# Altium project DecadeBox.PrjPcb
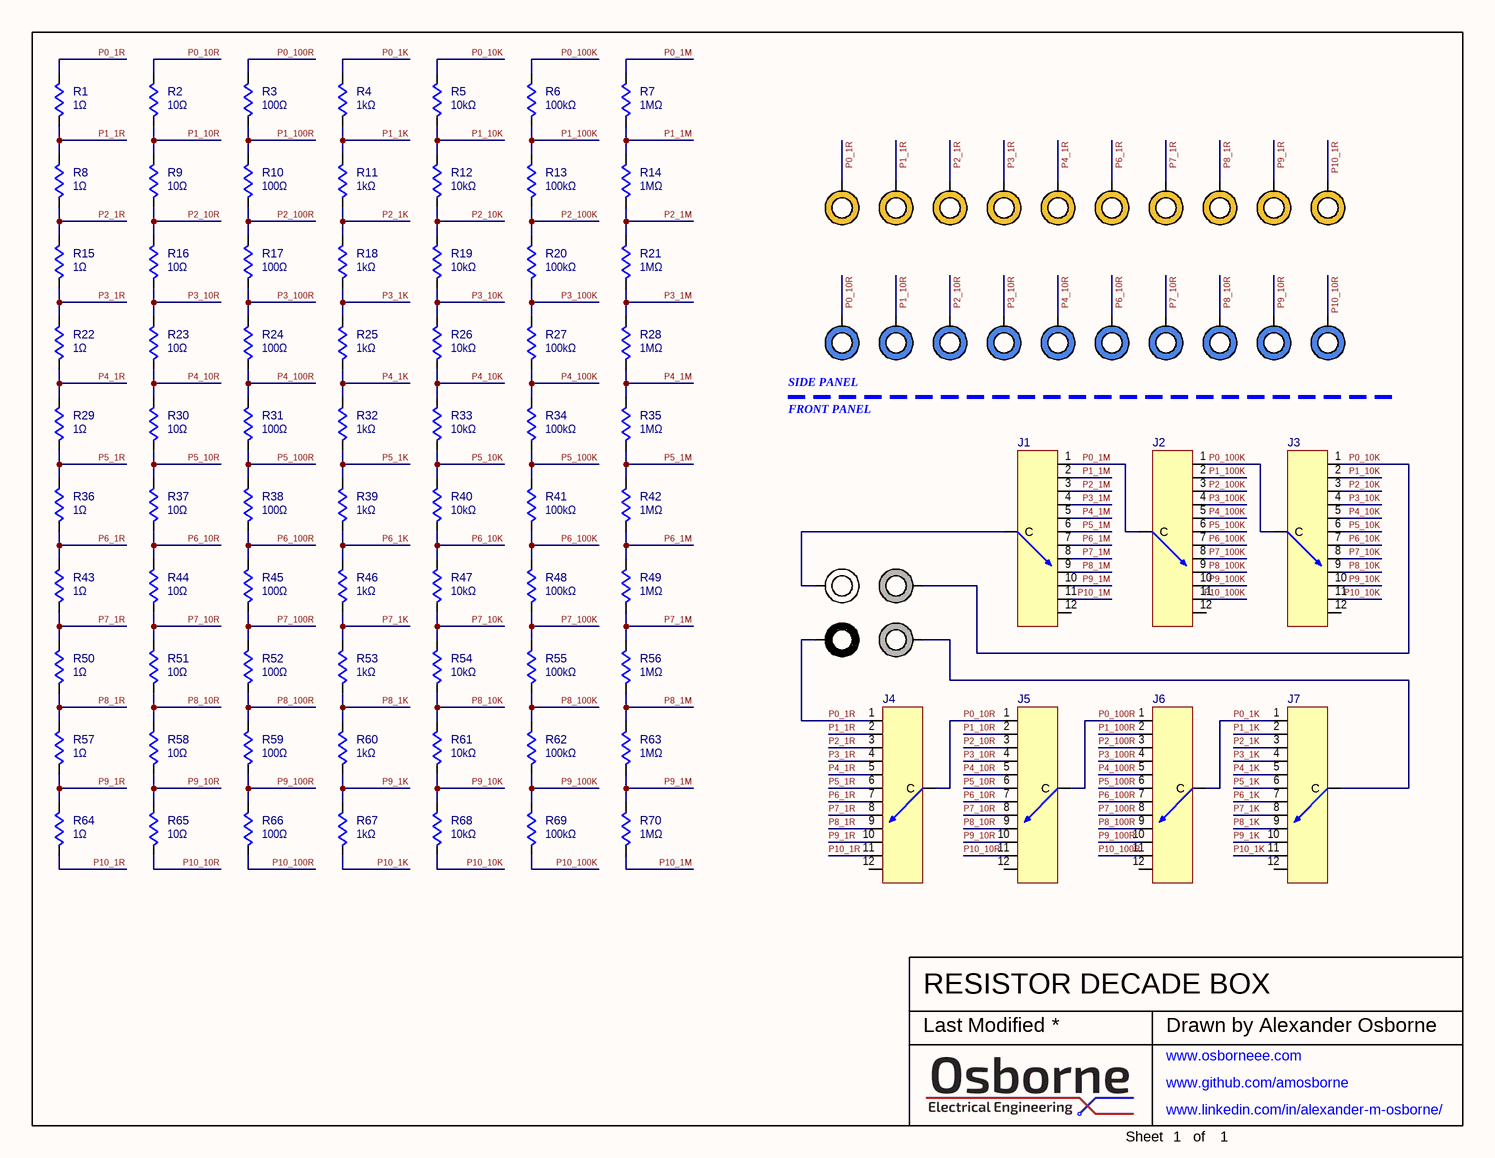
[diagram p0: DecadeBox.SchDoc]
1 sheet, 101 parts. Net scope: global (net labels, ports and power ports of the same name join across sheets).

## Sheet DecadeBox.SchDoc: RESISTOR DECADE BOX
size Letter; SheetNumber: 1; SheetTotal: 1

### Parts
J1  56SD30-01-1-AJS-ND  (value not drawn)
J2  56SD30-01-1-AJS-ND  (value not drawn)
J3  56SD30-01-1-AJS-ND  (value not drawn)
J4  56SD30-01-1-AJS-ND  (value not drawn)
J5  56SD30-01-1-AJS-ND  (value not drawn)
J6  56SD30-01-1-AJS-ND  (value not drawn)
J7  56SD30-01-1-AJS-ND  (value not drawn)
J8  501-1470-ND  (value not drawn)
J9  501-1714-ND  (value not drawn)
J10  501-2472-ND  (value not drawn)
J11  501-1714-ND  (value not drawn)
J12  501-1082-ND  (value not drawn)
J13  501-1082-ND  (value not drawn)
J14  501-1082-ND  (value not drawn)
J15  501-1082-ND  (value not drawn)
J16  501-1082-ND  (value not drawn)
J17  501-1082-ND  (value not drawn)
J18  501-1082-ND  (value not drawn)
J19  501-1082-ND  (value not drawn)
J20  501-1082-ND  (value not drawn)
J21  501-1082-ND  (value not drawn)
J22  501-1084-ND  (value not drawn)
J23  501-1084-ND  (value not drawn)
J24  501-1084-ND  (value not drawn)
J25  501-1084-ND  (value not drawn)
J26  501-1084-ND  (value not drawn)
J27  501-1084-ND  (value not drawn)
J28  501-1084-ND  (value not drawn)
J29  501-1084-ND  (value not drawn)
J30  501-1084-ND  (value not drawn)
J31  501-1084-ND  (value not drawn)
R1  value 1Ω  [MRS25]  (hidden comment: KAL10FB1R00-ND)
R2  value 10Ω  [MRS25]  (hidden comment: 696-1491-ND)
R3  value 100Ω  [MRS25]  (hidden comment: PPC100ZCT-ND)
R4  value 1kΩ  [MRS25]  (hidden comment: PPC1.00KZCT-ND)
R5  value 10kΩ  [MRS25]  (hidden comment: BC3955CT-ND)
R6  value 100kΩ  [MRS25]  (hidden comment: BC3327CT-ND)
R7  value 1MΩ  [MRS25]  (hidden comment: 56-MRS25000C1004FRP00CT-ND)
R8  value 1Ω  [MRS25]  (hidden comment: KAL10FB1R00-ND)
R9  value 10Ω  [MRS25]  (hidden comment: 696-1491-ND)
R10  value 100Ω  [MRS25]  (hidden comment: PPC100ZCT-ND)
R11  value 1kΩ  [MRS25]  (hidden comment: PPC1.00KZCT-ND)
R12  value 10kΩ  [MRS25]  (hidden comment: BC3955CT-ND)
R13  value 100kΩ  [MRS25]  (hidden comment: BC3327CT-ND)
R14  value 1MΩ  [MRS25]  (hidden comment: 56-MRS25000C1004FRP00CT-ND)
R15  value 1Ω  [MRS25]  (hidden comment: KAL10FB1R00-ND)
R16  value 10Ω  [MRS25]  (hidden comment: 696-1491-ND)
R17  value 100Ω  [MRS25]  (hidden comment: PPC100ZCT-ND)
R18  value 1kΩ  [MRS25]  (hidden comment: PPC1.00KZCT-ND)
R19  value 10kΩ  [MRS25]  (hidden comment: BC3955CT-ND)
R20  value 100kΩ  [MRS25]  (hidden comment: BC3327CT-ND)
R21  value 1MΩ  [MRS25]  (hidden comment: 56-MRS25000C1004FRP00CT-ND)
R22  value 1Ω  [MRS25]  (hidden comment: KAL10FB1R00-ND)
R23  value 10Ω  [MRS25]  (hidden comment: 696-1491-ND)
R24  value 100Ω  [MRS25]  (hidden comment: PPC100ZCT-ND)
R25  value 1kΩ  [MRS25]  (hidden comment: PPC1.00KZCT-ND)
R26  value 10kΩ  [MRS25]  (hidden comment: BC3955CT-ND)
R27  value 100kΩ  [MRS25]  (hidden comment: BC3327CT-ND)
R28  value 1MΩ  [MRS25]  (hidden comment: 56-MRS25000C1004FRP00CT-ND)
R29  value 1Ω  [MRS25]  (hidden comment: KAL10FB1R00-ND)
R30  value 10Ω  [MRS25]  (hidden comment: 696-1491-ND)
R31  value 100Ω  [MRS25]  (hidden comment: PPC100ZCT-ND)
R32  value 1kΩ  [MRS25]  (hidden comment: PPC1.00KZCT-ND)
R33  value 10kΩ  [MRS25]  (hidden comment: BC3955CT-ND)
R34  value 100kΩ  [MRS25]  (hidden comment: BC3327CT-ND)
R35  value 1MΩ  [MRS25]  (hidden comment: 56-MRS25000C1004FRP00CT-ND)
R36  value 1Ω  [MRS25]  (hidden comment: KAL10FB1R00-ND)
R37  value 10Ω  [MRS25]  (hidden comment: 696-1491-ND)
R38  value 100Ω  [MRS25]  (hidden comment: PPC100ZCT-ND)
R39  value 1kΩ  [MRS25]  (hidden comment: PPC1.00KZCT-ND)
R40  value 10kΩ  [MRS25]  (hidden comment: BC3955CT-ND)
R41  value 100kΩ  [MRS25]  (hidden comment: BC3327CT-ND)
R42  value 1MΩ  [MRS25]  (hidden comment: 56-MRS25000C1004FRP00CT-ND)
R43  value 1Ω  [MRS25]  (hidden comment: KAL10FB1R00-ND)
R44  value 10Ω  [MRS25]  (hidden comment: 696-1491-ND)
R45  value 100Ω  [MRS25]  (hidden comment: PPC100ZCT-ND)
R46  value 1kΩ  [MRS25]  (hidden comment: PPC1.00KZCT-ND)
R47  value 10kΩ  [MRS25]  (hidden comment: BC3955CT-ND)
R48  value 100kΩ  [MRS25]  (hidden comment: BC3327CT-ND)
R49  value 1MΩ  [MRS25]  (hidden comment: 56-MRS25000C1004FRP00CT-ND)
R50  value 1Ω  [MRS25]  (hidden comment: KAL10FB1R00-ND)
R51  value 10Ω  [MRS25]  (hidden comment: 696-1491-ND)
R52  value 100Ω  [MRS25]  (hidden comment: PPC100ZCT-ND)
R53  value 1kΩ  [MRS25]  (hidden comment: PPC1.00KZCT-ND)
R54  value 10kΩ  [MRS25]  (hidden comment: BC3955CT-ND)
R55  value 100kΩ  [MRS25]  (hidden comment: BC3327CT-ND)
R56  value 1MΩ  [MRS25]  (hidden comment: 56-MRS25000C1004FRP00CT-ND)
R57  value 1Ω  [MRS25]  (hidden comment: KAL10FB1R00-ND)
R58  value 10Ω  [MRS25]  (hidden comment: 696-1491-ND)
R59  value 100Ω  [MRS25]  (hidden comment: PPC100ZCT-ND)
R60  value 1kΩ  [MRS25]  (hidden comment: PPC1.00KZCT-ND)
R61  value 10kΩ  [MRS25]  (hidden comment: BC3955CT-ND)
R62  value 100kΩ  [MRS25]  (hidden comment: BC3327CT-ND)
R63  value 1MΩ  [MRS25]  (hidden comment: 56-MRS25000C1004FRP00CT-ND)
R64  value 1Ω  [MRS25]  (hidden comment: KAL10FB1R00-ND)
R65  value 10Ω  [MRS25]  (hidden comment: 696-1491-ND)
R66  value 100Ω  [MRS25]  (hidden comment: PPC100ZCT-ND)
R67  value 1kΩ  [MRS25]  (hidden comment: PPC1.00KZCT-ND)
R68  value 10kΩ  [MRS25]  (hidden comment: BC3955CT-ND)
R69  value 100kΩ  [MRS25]  (hidden comment: BC3327CT-ND)
R70  value 1MΩ  [MRS25]  (hidden comment: 56-MRS25000C1004FRP00CT-ND)

### Nets
P0_1K: J6.13(C) J7.1 R4.1
P0_1M: J1.1 J2.13(C) R7.1
P0_1R: J4.1 J10.1 J12.1 R1.1
P0_10K: J3.1 J9.1 R5.1
P0_10R: J4.13(C) J5.1 J22.1 R2.1
P0_100K: J2.1 J3.13(C) R6.1
P0_100R: J5.13(C) J6.1 R3.1
P1_1K: J7.2 R4.2 R11.1
P1_1M: J1.2 R7.2 R14.1
P1_1R: J4.2 J13.1 R1.2 R8.1
P1_10K: J3.2 R5.2 R12.1
P1_10R: J5.2 J23.1 R2.2 R9.1
P1_100K: J2.2 R6.2 R13.1
P1_100R: J6.2 R3.2 R10.1
P2_1K: J7.3 R11.2 R18.1
P2_1M: J1.3 R14.2 R21.1
P2_1R: J4.3 J14.1 R8.2 R15.1
P2_10K: J3.3 R12.2 R19.1
P2_10R: J5.3 J24.1 R9.2 R16.1
P2_100K: J2.3 R13.2 R20.1
P2_100R: J6.3 R10.2 R17.1
P3_1K: J7.4 R18.2 R25.1
P3_1M: J1.4 R21.2 R28.1
P3_1R: J4.4 J15.1 R15.2 R22.1
P3_10K: J3.4 R19.2 R26.1
P3_10R: J5.4 J25.1 R16.2 R23.1
P3_100K: J2.4 R20.2 R27.1
P3_100R: J6.4 R17.2 R24.1
P4_1K: J7.5 R25.2 R32.1
P4_1M: J1.5 R28.2 R35.1
P4_1R: J4.5 J16.1 R22.2 R29.1
P4_10K: J3.5 R26.2 R33.1
P4_10R: J5.5 J26.1 R23.2 R30.1
P4_100K: J2.5 R27.2 R34.1
P4_100R: J6.5 R24.2 R31.1
P5_1K: J7.6 R32.2 R39.1
P5_1M: J1.6 R35.2 R42.1
P5_1R: J4.6 R29.2 R36.1
P5_10K: J3.6 R33.2 R40.1
P5_10R: J5.6 R30.2 R37.1
P5_100K: J2.6 R34.2 R41.1
P5_100R: J6.6 R31.2 R38.1
P6_1K: J7.7 R39.2 R46.1
P6_1M: J1.7 R42.2 R49.1
P6_1R: J4.7 J17.1 R36.2 R43.1
P6_10K: J3.7 R40.2 R47.1
P6_10R: J5.7 J27.1 R37.2 R44.1
P6_100K: J2.7 R41.2 R48.1
P6_100R: J6.7 R38.2 R45.1
P7_1K: J7.8 R46.2 R53.1
P7_1M: J1.8 R49.2 R56.1
P7_1R: J4.8 J18.1 R43.2 R50.1
P7_10K: J3.8 R47.2 R54.1
P7_10R: J5.8 J28.1 R44.2 R51.1
P7_100K: J2.8 R48.2 R55.1
P7_100R: J6.8 R45.2 R52.1
P8_1K: J7.9 R53.2 R60.1
P8_1M: J1.9 R56.2 R63.1
P8_1R: J4.9 J19.1 R50.2 R57.1
P8_10K: J3.9 R54.2 R61.1
P8_10R: J5.9 J29.1 R51.2 R58.1
P8_100K: J2.9 R55.2 R62.1
P8_100R: J6.9 R52.2 R59.1
P9_1K: J7.10 R60.2 R67.1
P9_1M: J1.10 R63.2 R70.1
P9_1R: J4.10 J20.1 R57.2 R64.1
P9_10K: J3.10 R61.2 R68.1
P9_10R: J5.10 J30.1 R58.2 R65.1
P9_100K: J2.10 R62.2 R69.1
P9_100R: J6.10 R59.2 R66.1
P10_1K: J7.11 R67.2
P10_1M: J1.11 R70.2
P10_1R: J4.11 J21.1 R64.2
P10_10K: J3.11 R68.2
P10_10R: J5.11 J31.1 R65.2
P10_100K: J2.11 R69.2
P10_100R: J6.11 R66.2
NetJ1_13: J1.13(C) J8.1
NetJ7_13: J7.13(C) J11.1

Not connected (* = marked no-connect by the designer): J1 12; J2 12; J3 12; J4 12; J5 12; J6 12; J7 12

### Notes on the sheet
- SIDE PANEL
- FRONT PANEL
- Last Modified
- Drawn by Alexander Osborne
- www.osborneee.com <http://www.osborneee.com>
- www.github.com/amosborne <http://www.github.com/amosborne>
- Sheet
- www.linkedin.com/in/alexander-m-osborne/ <http://www.linkedin.com/in/alexander-m-osborne/>
- of

### Library data of the parts
J1-J7 = ROTARY: 12 POLE, SINGLE THROW, ROTARY SWITCH; Supplier 1: Digi-Key; Supplier Part Number 1: 56SD30-01-1-AJS-ND
J8 = POST-WHT: BINDING POST, WHITE; Supplier 1: Digi-Key; Supplier Part Number 1: 501-1470-ND
J9 J11 = POST-GRY: BINDING POST, GRAY; Supplier 1: Digi-Key; Supplier Part Number 1: 501-1714-ND
J10 = POST-BLK: BINDING POST, BLACK; Supplier 1: Digi-Key; Supplier Part Number 1: 501-2472-ND
J12-J21 = POST-YEL: BINDING POST, YELLOW; Supplier 1: Digi-Key; Supplier Part Number 1: 501-1082-ND
J22-J31 = POST-BLU: BINDING POST, BLUE; Supplier 1: Digi-Key; Supplier Part Number 1: 501-1084-ND
R1 R8 R15 R22 R29 R36 R43 R50 R57 R64 = RES-1OHM: RES 1Ω 1% 50ppm/K 12.5W; Tolerance: 1% + 50ppm/K; Supplier 1: Digi-Key; Supplier Part Number 1: KAL10FB1R00-ND; Power: 12.5W
R2 R9 R16 R23 R30 R37 R44 R51 R58 R65 = RES-10OHM: RES 10Ω 1% 50ppm/K 10W; Tolerance: 1% + 50ppm/K; Supplier 1: Digi-Key; Supplier Part Number 1: 696-1491-ND; Power: 10W
R3 R10 R17 R24 R31 R38 R45 R52 R59 R66 = RES-100OHM: RES 100Ω 1% 50ppm/K 600mW; Tolerance: 1% + 50ppm/K; Supplier 1: Digi-Key; Supplier Part Number 1: PPC100ZCT-ND; Power: 600mW
R4 R11 R18 R25 R32 R39 R46 R53 R60 R67 = RES-1KOHM: RES 1kΩ 1% 50ppm/K 600mW; Tolerance: 1% + 50ppm/K; Supplier 1: Digi-Key; Supplier Part Number 1: PPC1.00KZCT-ND; Power: 600mW
R5 R12 R19 R26 R33 R40 R47 R54 R61 R68 = RES-10KOHM: RES 10kΩ 1% 50ppm/K 600mW; Tolerance: 1% + 50ppm/K; Supplier 1: Digi-Key; Supplier Part Number 1: BC3955CT-ND; Power: 600mW
R6 R13 R20 R27 R34 R41 R48 R55 R62 R69 = RES-100KOHM: RES 100kΩ 1% 50ppm/K 600mW; Tolerance: 1% + 50ppm/K; Supplier 1: Digi-Key; Supplier Part Number 1: BC3327CT-ND; Power: 600mW
R7 R14 R21 R28 R35 R42 R49 R56 R63 R70 = RES-1MOHM: RES 1MΩ 1% 50ppm/K 600mW; Tolerance: 1% + 50ppm/K; Supplier 1: Digi-Key; Supplier Part Number 1: 56-MRS25000C1004FRP00CT-ND; Power: 600mW